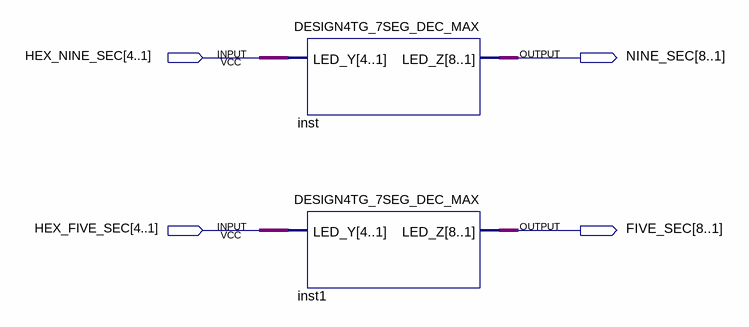
[diagram p0: schematic sheet]
// Quartus schematic DESIGN4TG_MAX.bdf as structural Verilog: 2 symbols, 4 pins
module DESIGN4TG_MAX (
  input  [4:1] HEX_NINE_SEC,
  input  [4:1] HEX_FIVE_SEC,
  output [8:1] NINE_SEC,
  output [8:1] FIVE_SEC
);

  DESIGN4TG_7SEG_DEC_MAX inst (.LED_Y(HEX_NINE_SEC), .LED_Z(NINE_SEC));
  DESIGN4TG_7SEG_DEC_MAX inst1 (.LED_Y(HEX_FIVE_SEC), .LED_Z(FIVE_SEC));
endmodule
